# Altium schematic sheet 32.768_crystal.SchDoc
size A4; SheetNumber: 3; SheetTotal: 3
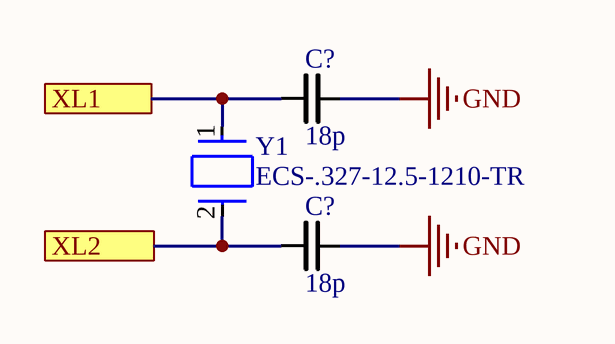
[diagram p0: 32.768_crystal.SchDoc]

## Parts
(Parts that share a designator on the sheet are numbered #1, #2 ... from top to bottom, then left to right.)
C?#1  18p
C?#2  18p
Y1  ECS-.327-12.5-1210-TR  [FP-ECX-1210-MFG]

## Ports
XL1, XL2

## Nets
GND: C?#1.2 C?#2.2
XL1: C?#1.1 Y1.1(In/Out) ; port XL1
XL2: C?#2.1 Y1.2(Out/In) ; port XL2

## Library data of the parts
C?#1 C?#2 = CAP_18p: Ceramic capacitor
Y1 = CMP-40224-000006-1: CRYSTAL 32.7680KHZ 12.5PF SMD; Manufacturer: ECS International; Frequency: 32.768kHz; Esr: 90kΩ; Tolerance: 20ppm; Device Class L1: Passive Components; Load Capacitance: 12.5pF; Temperature: -40°C to +85°C; ComponentLink2URL: https://ecsxtal.com/store/pdf/ECX-1210.pdf; Series: ECX-1210; Octopart: https://octopart.com/ecs-.327-12.5-1210-tr-ecs+international-81221340; ComponentLink2Description: Datasheet; Temperature Range Low: -40°C; Digikey Description: CRYSTAL 32.7680KHZ 12.5PF SMD; Lead Free: Yes; RoHS: TRUE; Device Class L3: Crystals; Automotive: No; Category: Crys; Height: 0.5mm; Manufacturer Part Number: ECS-.327-12.5-1210-TR; Temperature Range High: +85°C; Device Class L2: Crystals / Oscillators; Package: ECX-1210